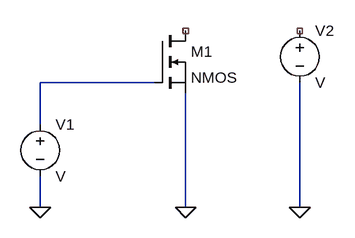
[diagram p0: schematic prednaska7.asc]
prednaska7.asc, the LTspice schematic file:
Version 4
SHEET 1 880 680
WIRE 240 64 64 64
WIRE 64 128 64 64
WIRE 64 256 64 208
WIRE 288 256 288 80
WIRE 464 256 464 64
FLAG 64 256 0
FLAG 288 256 0
FLAG 464 256 0
SYMBOL voltage 64 112 R0
SYMATTR InstName V1
SYMBOL nmos 240 -16 R0
SYMATTR InstName M1
SYMBOL voltage 464 -32 R0
SYMATTR InstName V2

The netlist it stands for:
* prednaska7.asc
V1 N001 0 V
M1 NC_01 N001 0 0 NMOS
V2 NC_02 0 V
.model NMOS NMOS
.model PMOS PMOS
.lib standard.mos
.backanno
.end